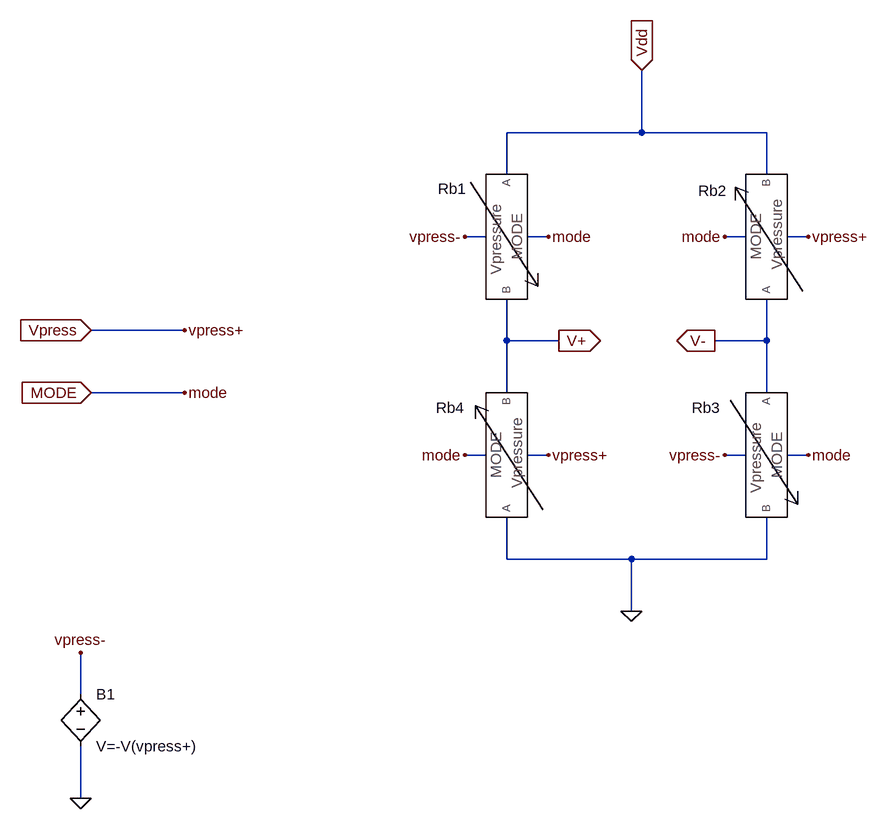
[diagram p0: schematic COM_WHEATSTONE.asc]
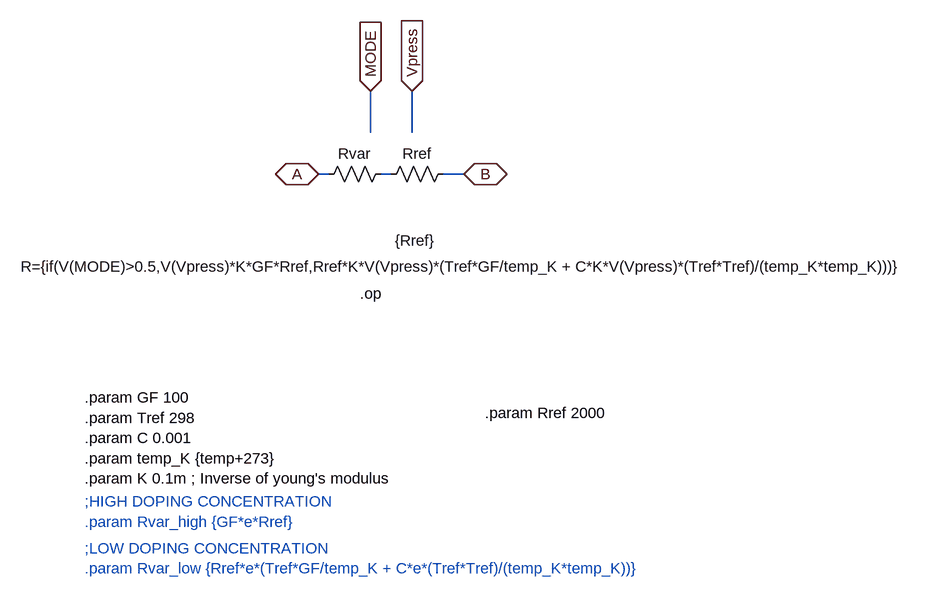
[diagram p1: sub-circuit sensor_res.asc]
COM_WHEATSTONE.asc, the LTspice schematic file:
Version 4
SHEET 1 1064 1200
WIRE 448 112 448 16
WIRE 448 112 240 112
WIRE 640 112 448 112
WIRE 240 176 240 112
WIRE 640 176 640 112
WIRE 208 272 176 272
WIRE 304 272 272 272
WIRE 608 272 576 272
WIRE 704 272 672 272
WIRE -256 416 -400 416
WIRE 240 432 240 368
WIRE 320 432 240 432
WIRE 640 432 640 368
WIRE 640 432 560 432
WIRE -256 512 -400 512
WIRE 240 512 240 432
WIRE 640 512 640 432
WIRE 208 608 176 608
WIRE 304 608 272 608
WIRE 608 608 576 608
WIRE 704 608 672 608
WIRE 240 768 240 704
WIRE 432 768 240 768
WIRE 640 768 640 704
WIRE 640 768 432 768
WIRE 432 848 432 768
WIRE -416 976 -416 912
WIRE -416 1136 -416 1056
FLAG 432 848 0
FLAG 176 608 mode
FLAG 304 272 mode
FLAG 704 608 mode
FLAG 576 272 mode
FLAG 304 608 vpress+
FLAG 704 272 vpress+
FLAG 576 608 vpress-
FLAG 176 272 vpress-
FLAG 448 16 Vdd
IOPIN 448 16 In
FLAG 320 432 V+
IOPIN 320 432 Out
FLAG 560 432 V-
IOPIN 560 432 Out
FLAG -416 1136 0
FLAG -416 912 vpress-
FLAG -400 416 Vpress
IOPIN -400 416 In
FLAG -256 416 vpress+
FLAG -400 512 MODE
IOPIN -400 512 In
FLAG -256 512 mode
SYMBOL SENSOR_RES 224 608 R270
WINDOW 0 57 -71 VTop 2
SYMATTR InstName Rb4
SYMBOL SENSOR_RES 656 608 R90
WINDOW 0 -88 109 VTop 2
SYMATTR InstName Rb3
SYMBOL SENSOR_RES 256 272 R90
WINDOW 0 -89 100 VTop 2
SYMATTR InstName Rb1
SYMBOL SENSOR_RES 624 272 R270
WINDOW 0 55 -67 VTop 2
SYMATTR InstName Rb2
SYMBOL bv -416 960 R0
SYMATTR InstName B1
SYMATTR Value V=-V(vpress+)

sensor_res.asc, the sub-circuit schematic file:
Version 4
SHEET 1 1248 1508
WIRE 400 272 400 208
WIRE 464 272 464 208
WIRE 336 336 320 336
WIRE 432 336 416 336
WIRE 544 336 512 336
FLAG 464 208 Vpress
IOPIN 464 208 In
FLAG 400 208 MODE
IOPIN 400 208 In
FLAG 320 336 A
IOPIN 320 336 BiDir
FLAG 544 336 B
IOPIN 544 336 BiDir
SYMBOL res 432 320 R90
WINDOW 0 0 56 VBottom 2
WINDOW 3 143 -113 VTop 2
SYMATTR InstName Rvar
SYMATTR Value R={if(V(MODE)>0.5,V(Vpress)*K*GF*Rref,Rref*K*V(Vpress)*(Tref*GF/temp_K + C*K*V(Vpress)*(Tref*Tref)/(temp_K*temp_K)))}
SYMBOL res 528 320 R90
WINDOW 0 0 56 VBottom 2
WINDOW 3 103 59 VTop 2
SYMATTR InstName Rref
SYMATTR Value {Rref}
TEXT -40 680 Left 2 !.param GF 100\n.param Tref 298\n.param C 0.001\n.param temp_K {temp+273}\n.param K 0.1m ; Inverse of young's modulus
TEXT -40 912 Left 2 ;;LOW DOPING CONCENTRATION\n.param Rvar_low {Rref*e*(Tref*GF/temp_K + C*e*(Tref*Tref)/(temp_K*temp_K))}
TEXT -40 840 Left 2 ;;HIGH DOPING CONCENTRATION\n.param Rvar_high {GF*e*Rref}
TEXT 576 704 Left 2 !.param Rref 2000
TEXT 384 520 Left 2 !.op

The netlist it stands for:
* COM_WHEATSTONE.asc
XRb4 mode Vpress 0 V+ sensor_res
XRb3 mode vpress- V- 0 sensor_res
XRb1 mode vpress- Vdd V+ sensor_res
XRb2 mode Vpress V- Vdd sensor_res
B1 vpress- 0 V=-V(vpress+)

* block symbol definitions
.subckt sensor_res MODE Vpress A B
Rvar N001 A R={if(V(MODE)>0.5,V(Vpress)*K*GF*Rref,Rref*K*V(Vpress)*(Tref*GF/temp_K + C*K*V(Vpress)*(Tref*Tref)/(temp_K*temp_K)))}
Rref B N001 {Rref}
.param GF 100
.param Tref 298
.param C 0.001
.param temp_K {temp+273}
.param K 0.1m ; Inverse of young's modulus
* ;LOW DOPING CONCENTRATION
* .param Rvar_low {Rref*e*(Tref*GF/temp_K + C*e*(Tref*Tref)/(temp_K*temp_K))}
* ;HIGH DOPING CONCENTRATION
* .param Rvar_high {GF*e*Rref}
.param Rref 2000
.op
.ends sensor_res

.backanno
.end